# EAGLE design pcc (EAGLE 7.4.0)
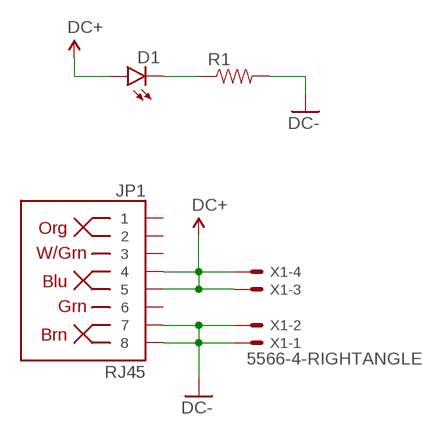
[diagram p0: schematic, sheet 1]

## Parts
D1  LED0603  [LED-0603]
JP1  RJ45  RJ45-8PTH  [RJ45-8]
R1  RESISTOR0603-RES  [0603-RES]
X1  5566-4-RIGHTANGLE  [5566-4]

## Nets
DC+: D1.A JP1.4 JP1.5 X1.3 X1.4
DC-: JP1.7 JP1.8 R1.2 X1.1 X1.2
N$1: D1.C R1.1
Unconnected: JP1.1 JP1.2 JP1.3 JP1.6

## Library data of the parts
D1 = SparkFun-LED:LED: LEDs Standard schematic elements and footprints for 5mm, 3mm, 1206, and 0603 sized LEDs. 5mm - Spark Fun Electronics SKU : COM-00529 (and others)
JP1 = SparkFun-Connectors:RJ45-8: RJ45 Jack Simple RJ45, 8-pin connection - connector for common Cat5, Cat5e, and Cat6 Ethernet cables. Footprint not yet proven in production. Connector sku is PRT-00643; Breakout PCB sku is BOB-00716.; PROD_ID: CONN-08506
R1 = SparkFun-Resistors:RESISTOR: Resistor Basic schematic elements and footprints for 0603, 1206, and PTH resistors.
X1 = SDSURocket-Connectors:5566-4: Mini FIT connector 4 pol Source: http://www.molex.com; OC_FARNELL: unknown; OC_NEWARK: unknown

## Board
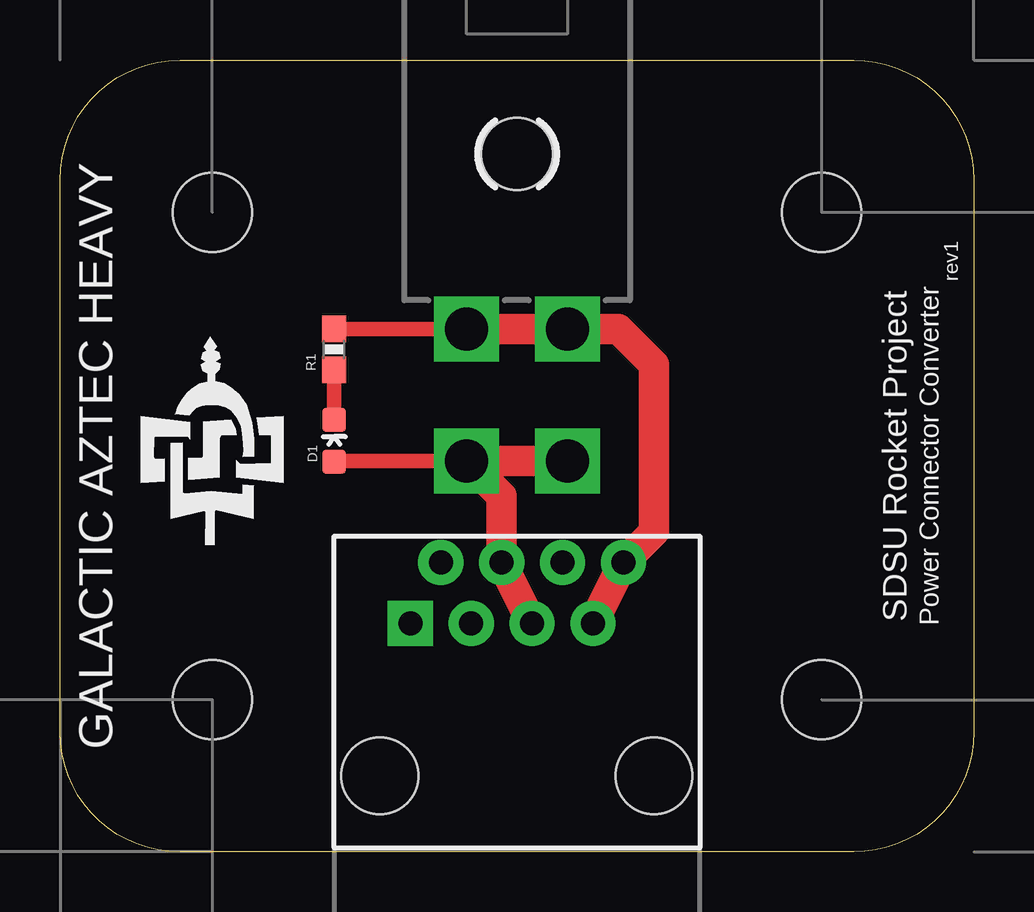
[diagram p1: board, top side]
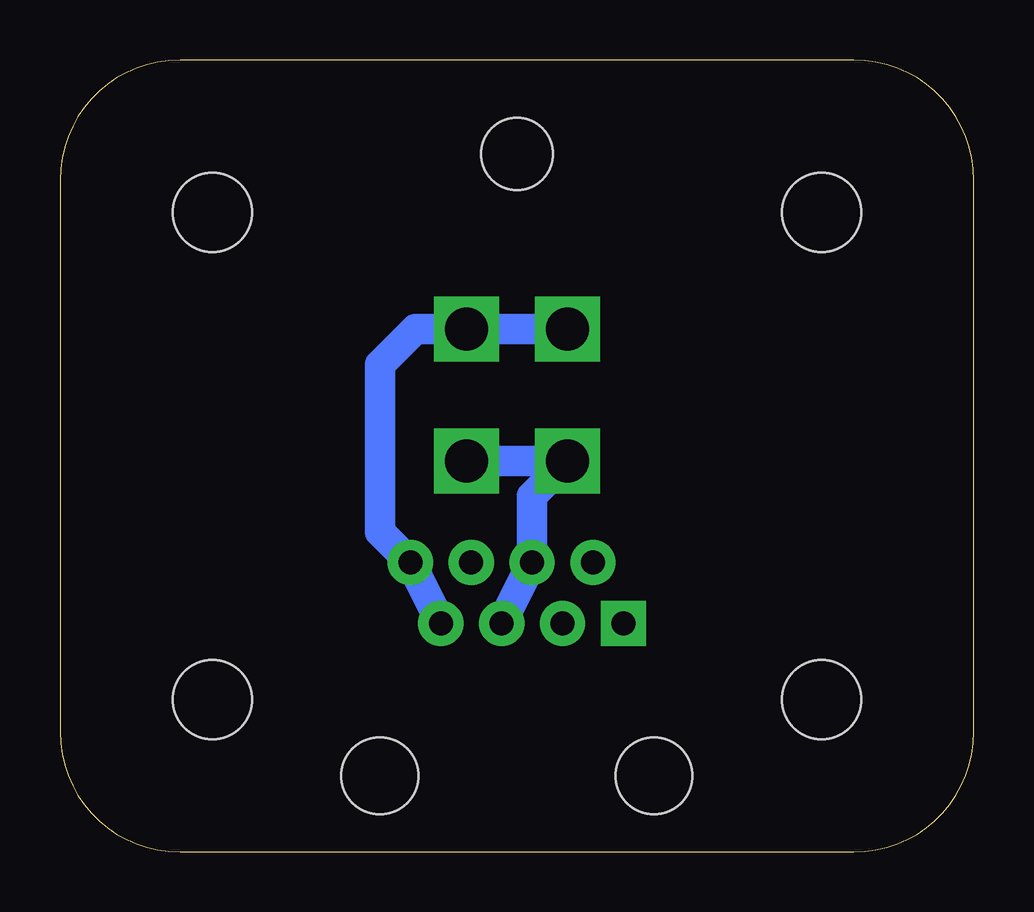
[diagram p2: board, bottom side, seen from below]

Size 38.1 x 33.02 mm. Coordinates in mm from the lower left corner, seen from the top.
Outline: 5,33.02 33.1,33.02 arc-90 38.1,28.02 38.1,5 arc-90 33.1,0 5,0 arc-90 0,5 0,28.02 arc-90 5,33.02
Copper layers (1*16): Top 0.0356mm / dielectric 1.5011mm / Bottom 0.0356mm
Design rules "SparkFunBestPractices": minimum track width 10mil, minimum drill 13mil, track to track 10mil, track to pad 10mil, pad to pad 10mil, via to via 10mil, smd to smd 10mil, copper to edge 15mil, drill to drill 12mil, minimum pad ring 7mil, minimum via ring 7mil, stop-mask expansion 3mil, vias tented up to drill 0mil, thermal gap 10mil

### Footprints (pad centres in the part's own frame; a part is rotated, then mirrored left to right if it is on the bottom)
LED-0603 = smd 1 x 1: A 0,-0.877; C 0,0.877
RJ45-8 = drill 1 pad 1.88 square: 1 -4.445,6.35 | drill 1 pad 1.88: 2 -3.175,8.89; 3 -1.905,6.35; 4 -0.635,8.89; 5 0.635,6.35; 6 1.905,8.89; 7 3.175,6.35; 8 4.445,8.89 | hole 3.2: -5.715,0; 5.715,0
0603-RES = smd 1.1 x 1: 1 -0.85,0; 2 0.85,0
STAND-OFF = hole 3.302: 0,0
5566-4 = drill 1.8 square: 1 2.1,-2.75; 2 -2.1,-2.75; 3 2.1,2.75; 4 -2.1,2.75 | hole 3: 0,-10.05

### Placement (x,y rotation side)
D1  11.43,17.14 0 top
JP1  19.05,3.17 0 top
R1  11.43,20.95 90 top
U$1  [STAND-OFF]  6.35,6.35 0 top
U$2  [STAND-OFF]  31.75,6.35 0 top
U$3  [STAND-OFF]  6.35,26.67 0 top
U$4  [STAND-OFF]  31.75,26.67 0 top
X1  19.05,19.05 180 top

### Tracks (layer width: path | path; a pad name or v marks a point on that pad's centre or on a via)
DC+
  Top 0.61: D1.A 11.46,16.3 X1.3
  Top 1.27: JP1.5 JP1.4 18.41,14.84 X1.3 X1.4
  Bottom 1.27: X1.4 X1.3 18.41,14.84 JP1.4 JP1.5
DC-
  Top 0.61: R1.2 X1.1
  Top 1.27: JP1.7 JP1.8 24.77,13.34 24.77,20.32 23.29,21.8 X1.2 X1.1
  Bottom 1.27: JP1.7 JP1.8 24.77,13.34 24.77,20.32 23.29,21.8 X1.2 X1.1
N$1
  Top 0.61: D1.C R1.1

### Text on the board
tNames: rev1 | GALACTIC AZTEC HEAVY | SDSU Rocket Project | Power Connector Converter